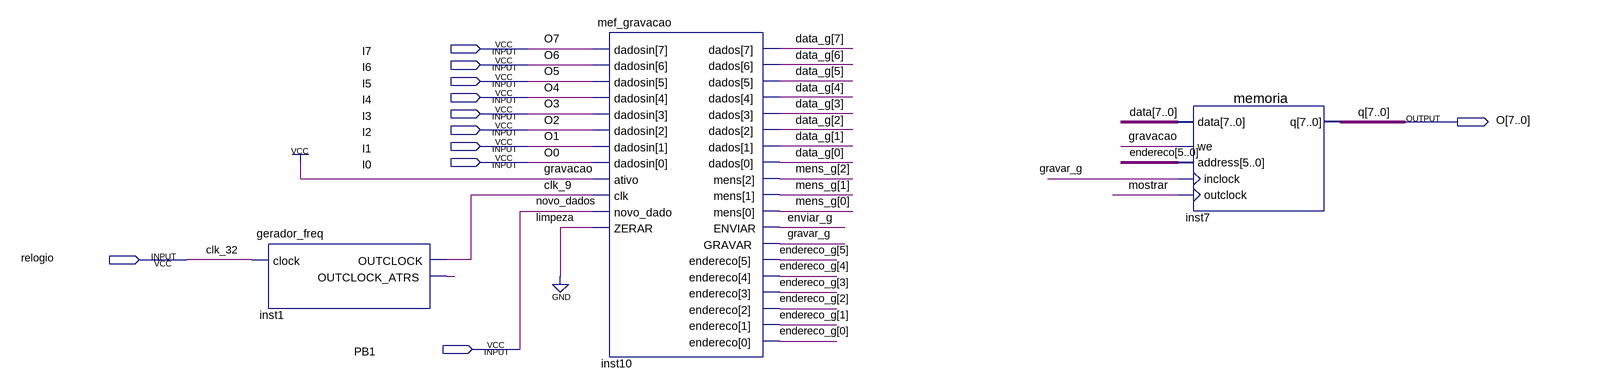
[diagram p0: schematic sheet]
// Quartus schematic Block1.bdf as structural Verilog: 3 symbols, 11 pins
module Block1 (
  input  I7,
  input  I6,
  input  I5,
  input  I4,
  input  I3,
  input  I2,
  input  I1,
  input  I0,
  input  relogio,
  input  PB1,
  output [7:0] O
);

  wire clk_9, enviar_g, gravar_g, inst1_outclock_atrs, mostrar;
  wire [2:0] mens_g;
  wire [5:0] endereco, endereco_g;
  wire [7:0] data, data_g;

  gerador_freq inst1 (.clock(relogio), .OUTCLOCK(clk_9), .OUTCLOCK_ATRS(inst1_outclock_atrs));
  mef_gravacao inst10 (
    .dadosin({I7, I6, I5, I4, I3, I2, I1, I0}), .ativo(1'b1), .clk(clk_9), .novo_dado(PB1), .ZERAR(1'b0),
    .dados(data_g), .mens(mens_g), .ENVIAR(enviar_g), .GRAVAR(gravar_g), .endereco(endereco_g));
  memoria inst7 (
    .data(data), .we(1'b1), .address(endereco), .inclock(gravar_g), .outclock(mostrar),
    .q({I7, I6, I5, I4, I3, I2, I1, I0}));

  assign O = {I7, I6, I5, I4, I3, I2, I1, I0};

  // Other names for the same wires on the sheet: clk_32 = relogio; novo_dados = PB1; O0 = I0;
  //   q[7:0] = {I7, I6, I5, I4, I3, I2, I1, I0}; O1 = I1; O2 = I2; O3 = I3; O4 = I4; O5 = I5; O6 = I6; O7 = I7
endmodule
